# EAGLE design gripper-board-rev1 (EAGLE 6.5.0)
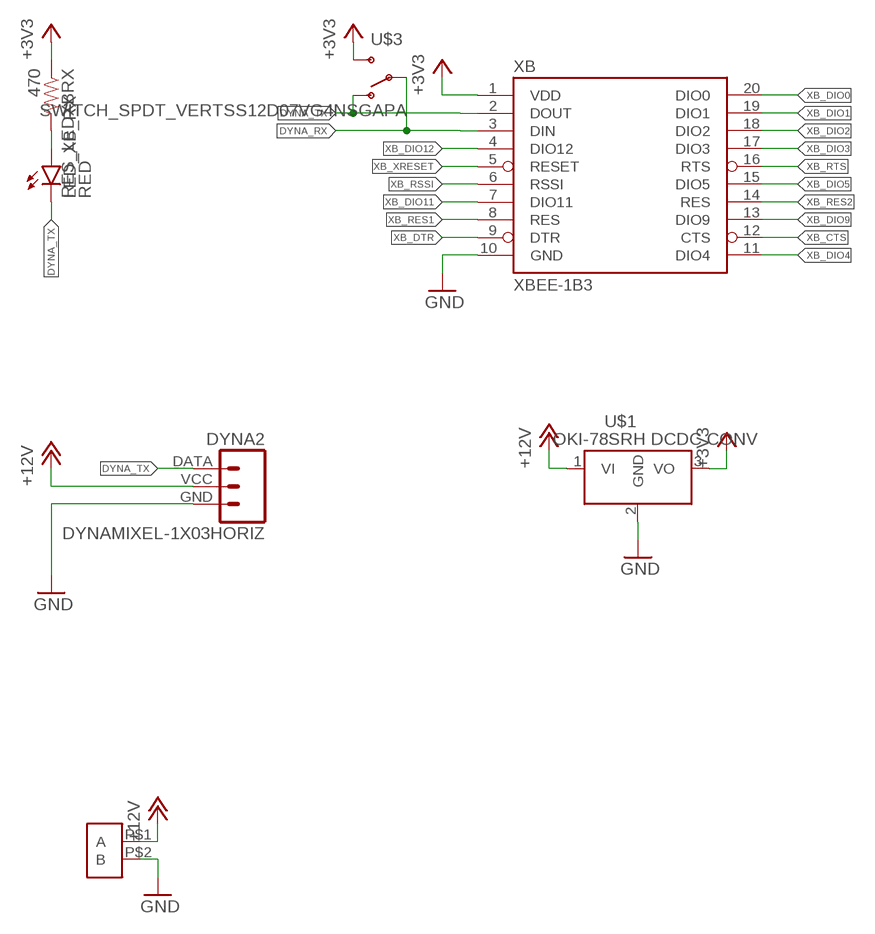
[diagram p0: schematic, sheet 1]

## Parts
DYNA2  DYNAMIXEL-1X03HORIZ  [MLX-SPOX5268-3PIN]
LED_XB_RX  RED  LED1206  [LED-1206]
RES_LEDXBRX  470  RESISTOR1206  [1206]
U$1  Q_OKI-78SR  [OKI-78SR_HORIZ]
U$2  2POS_TERM_BLOCKPHOENIX-1935161  [PHOENIX-1935161]
U$3  SWITCH_SPDT_VERTSS12D07VG4NSGAPA  [C&K-SS12D07VG4NSGAPA]
XB  XBEE-1B3  [XBEE-SMD]

## Nets
+3V3: RES_LEDXBRX.1 U$1.3(VO) U$3.P$3(S) XB.1(VDD)
+12V: DYNA2.VCC U$1.1(VI) U$2.P$1(A)
DYNA_RX: U$3.P$2(P) XB.3(DIN)
DYNA_TX: DYNA2.DATA LED_XB_RX.C U$3.P$1(O) XB.2(DOUT)
GND: DYNA2.GND U$1.2(GND) U$2.P$2(B) XB.10(GND)
N$1: LED_XB_RX.A RES_LEDXBRX.2
XB_CTS: XB.12(CTS)
XB_DIO0: XB.20(DIO0)
XB_DIO1: XB.19(DIO1)
XB_DIO2: XB.18(DIO2)
XB_DIO3: XB.17(DIO3)
XB_DIO4: XB.11(DIO4)
XB_DIO5: XB.15(DIO5)
XB_DIO9: XB.13(DIO9)
XB_DIO11: XB.7(DIO11)
XB_DIO12: XB.4(DIO12)
XB_DTR: XB.9(DTR)
XB_RES1: XB.8(RES)
XB_RES2: XB.14(RES)
XB_RSSI: XB.6(RSSI)
XB_RTS: XB.16(RTS)
XB_XRESET: XB.5(RESET)

## Library data of the parts
DYNA2 = MRDT-2015-Arm:DYNAMIXEL-1X03; MFR: Molex; MFR_PN: 0022057035; ORIENT: Horiz
LED_XB_RX = SparkFun-LED:LED: LEDs Standard schematic elements and footprints for 5mm, 3mm, 1206, and 0603 sized LEDs. 5mm - Spark Fun Electronics SKU : COM-00529 (and others)
RES_LEDXBRX = SparkFun-Passives:RESISTOR: Resistor Basic schematic elements and footprints for 0603, 1206, and PTH resistors.
U$1 = MRDT-2015-PowerBoard:Q_OKI-78SR: 4.95W DC/DC Converter Manufacturer: Murata Part Number: OKI-78SR-5/1.5-W36H-C OKI-78SR-3.3/1.5-W36H-C
U$2 = MRDT-2015-General:2POS_TERM_BLOCK
U$3 = MRDT-Electromechanical:SWITCH_SPDT_VERT
XB = SparkFun:XBEE-1

## Board
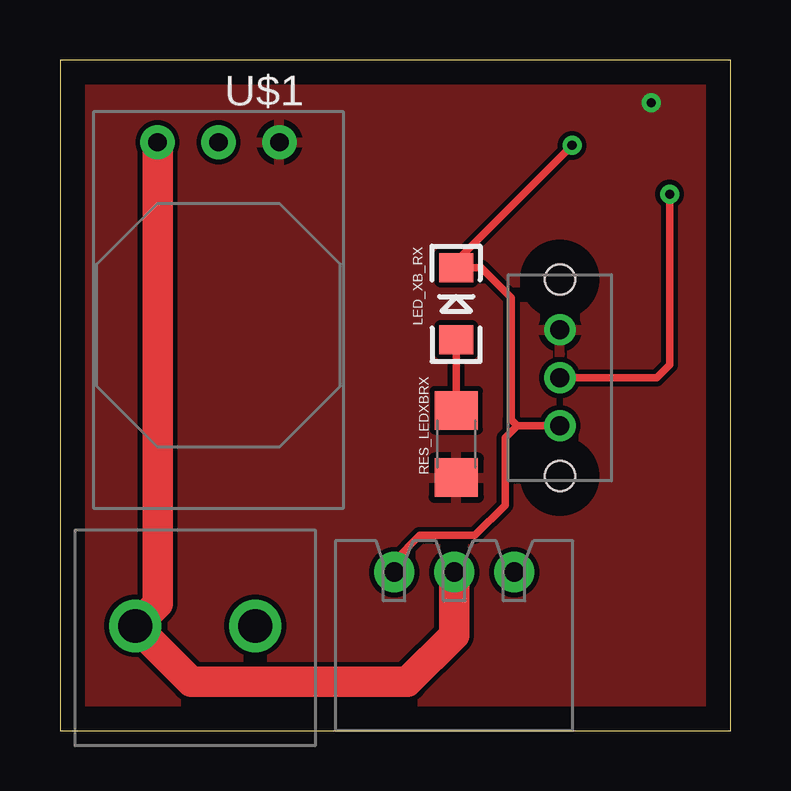
[diagram p1: board, top side]
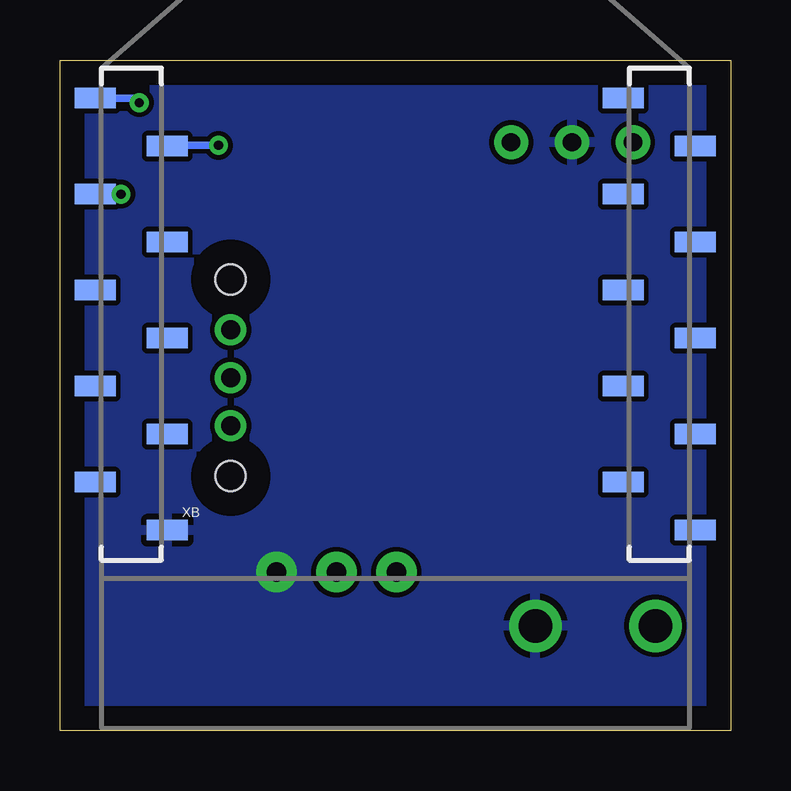
[diagram p2: board, bottom side, seen from below]

Size 27.94 x 27.94 mm. Coordinates in mm from the lower left corner, seen from the top.
Outline: 0,0 27.94,0 27.94,27.94 0,27.94 0,0
Copper layers (1*16): Top 0.035mm / dielectric 1.5mm / Bottom 0.035mm
Design rules "default": minimum track width 10mil, minimum drill 24mil, track to track 8mil, track to pad 8mil, pad to pad 8mil, via to via 8mil, smd to smd 8mil, copper to edge 40mil, drill to drill 8mil, minimum pad ring 10mil, minimum via ring 8mil, stop-mask expansion 4mil, vias tented up to drill 0mil, thermal gap 10mil

### Footprints (pad centres in the part's own frame; a part is rotated, then mirrored left to right if it is on the bottom)
MLX-SPOX5268-3PIN = drill 0.8 pad 1.676: DATA 5,0; GND 0,0; VCC 2.5,0
LED-1206 = smd 1.2 x 1.4: A -1.5,0; C 1.5,0
1206 = smd 1.6 x 1.8: 1 -1.4,0; 2 1.4,0
OKI-78SR_HORIZ = drill 0.762 pad 1.422: 1 0,0; 2 -2.54,0; 3 -5.08,0
PHOENIX-1935161 = drill 1.4 pad 2.184: P$1 2.5,5; P$2 7.5,5
C&K-SS12D07VG4NSGAPA = drill 0.8: P$1 0,0; P$2 2,0; P$3 4,0 | hole 1.25: -2.1,0; 6.1,0
XBEE-SMD = smd 1.7 x 0.85: 1 -12.5,20; 2 -9.5,18; 3 -12.5,16; 4 -9.5,14; 5 -12.5,12; 6 -9.5,10; 7 -12.5,8; 8 -9.5,6; 9 -12.5,4; 10 -9.5,2; 11 12.5,2; 12 9.5,4; 13 12.5,6; 14 9.5,8; 15 12.5,10; 16 9.5,12; 17 12.5,14; 18 9.5,16; 19 12.5,18; 20 9.5,20

### Placement (x,y rotation side)
DYNA2  18.92,6.6 180 top
LED_XB_RX  16.51,17.78 90 top
RES_LEDXBRX  16.51,11.94 90 top
U$1  4.06,24.51 180 top
U$2  0.64,-0.64 0 top
U$3  20.83,12.7 90 top
XB  13.97,6.35 0 bottom

### Tracks (layer width: path | path; a pad name or v marks a point on that pad's centre or on a via)
+3V3  (via drill 0.38)
  Top 0.305: v24.64,26.16 24.38,26.16
  Bottom 0.305: XB.1 24.83,26.35 v24.64,26.16
  pour Top: -3.81,35.56 -3.81,-3.81 36.83,-3.81 36.83,35.56
+12V
  Top 1.27: DYNA2.VCC 16.42,3.98 14.48,2.03 5.47,2.03 U$2.P$1 4.06,5.29 U$1.1
DYNA_RX  (via drill 0.38)
  Top 0.305: U$3.P$2 24.86,14.7 25.4,15.24 v25.4,22.35
  Bottom 0.305: v25.4,22.35 XB.3
DYNA_TX  (via drill 0.38)
  Top 0.305: DYNA2.DATA 13.92,7.07 14.99,8.13 17.27,8.13 18.54,9.4 18.54,12.19 19.05,12.7 | 19.05,12.7 U$3.P$1 | 19.05,12.7 18.8,12.95 18.8,18.03 17.55,19.28 LED_XB_RX.C 16.51,19.56 v21.34,24.38
  Bottom 0.305: v21.34,24.38 23.44,24.38 XB.2
GND
  pour Bottom: -10.16,30.48 -10.16,-7.62 31.75,-7.62 31.75,30.48
N$1
  Top 0.305: RES_LEDXBRX.2 LED_XB_RX.A